# Altium schematic sheet 12V_Buck_Motor.SchDoc
size 259 x 167 mm; SheetNumber: 3; SheetTotal: 7
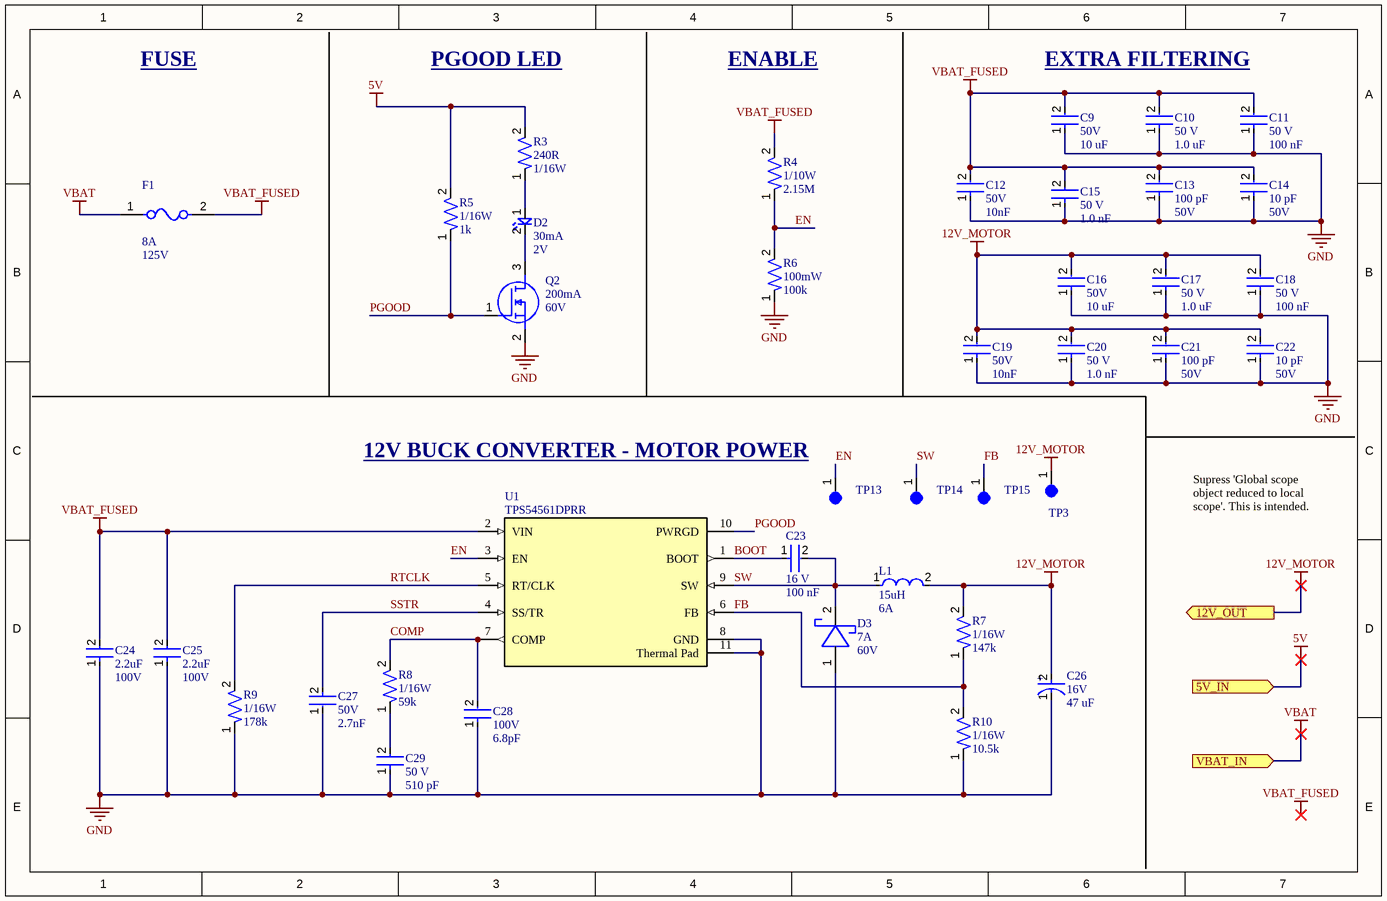
[diagram p0: 12V_Buck_Motor.SchDoc]

## Parts
C9  Voltage: 50V  Capacitance: 10 uF  [CAP-1210]  (hidden comment: CL32B106KBJNNNE)
C10  Voltage: 50 V  Capacitance: 1.0 uF  [CAP-0805]  (hidden comment: CC0805KKX7R9BB105)
C11  Voltage Rating: 50 V  Capacitance: 100 nF  [CAP-0805]  (hidden comment: CC0805KRX7R9BB104)
C12  Voltage: 50V  Capacitance: 10nF  [CAP-0805]  (hidden comment: GRM2195C1H103JA01D)
C13  Capacitance: 100 pF  Voltage: 50V  [CAP-0402]  (hidden comment: CC0402JRNPO9BN101)
C14  Capacitance: 10 pF  Voltage: 50V  [CAP-0402]  (hidden comment: CC0402JRNPO9BN100)
C15  Voltage: 50 V  Capacitance: 1.0 nF  [CAP-0402]  (hidden comment: CC0402KRX7R9BB102)
C16  Voltage: 50V  Capacitance: 10 uF  [CAP-1210]  (hidden comment: CL32B106KBJNNNE)
C17  Voltage: 50 V  Capacitance: 1.0 uF  [CAP-0805]  (hidden comment: CC0805KKX7R9BB105)
C18  Voltage Rating: 50 V  Capacitance: 100 nF  [CAP-0805]  (hidden comment: CC0805KRX7R9BB104)
C19  Voltage: 50V  Capacitance: 10nF  [CAP-0805]  (hidden comment: GRM2195C1H103JA01D)
C20  Voltage: 50 V  Capacitance: 1.0 nF  [CAP-0402]  (hidden comment: CC0402KRX7R9BB102)
C21  Capacitance: 100 pF  Voltage: 50V  [CAP-0402]  (hidden comment: CC0402JRNPO9BN101)
C22  Capacitance: 10 pF  Voltage: 50V  [CAP-0402]  (hidden comment: CC0402JRNPO9BN100)
C23  Voltage Rating: 16 V  Capacitance: 100 nF  [CAP-0402]  (hidden comment: CC0402KRX7R7BB104)
C24  Capacitance: 2.2uF  Voltage: 100V  [CAP-1206]  (hidden comment: CC1206KKX7R0BB225)
C25  Capacitance: 2.2uF  Voltage: 100V  [CAP-1206]  (hidden comment: CC1206KKX7R0BB225)
C26  Voltage: 16V  Capacitance: 47 uF  [CAP-47U-0001]  (hidden comment: 16SVPG47M)
C27  Voltage: 50V  Capacitance: 2.7nF  [CAP-0805]  (hidden comment: GRM2165C1H272JA01D)
C28  Voltage: 100V  Capacitance: 6.8pF  [CAP-0603]  (hidden comment: CC0603CRNPO0BN6R8)
C29  Voltage: 50 V  Capacitance: 510 pF  [CAP-0402]  (hidden comment: 0402N511J500CT)
D2  Forward Current: 30mA  Forward Voltage: 2V  [LED-0603]  (hidden comment: BL-HKC36G-AV-TRB)
D3  Forward Current: 7A  Reverse Voltage (DC): 60V  [DO-POWERDI5]  (hidden comment: PDS760-13)
F1  Fuse Current: 8A  Voltage Rating: 125V  [FUSE-0001]  (hidden comment: 01550900M)
L1  Inductance: 15uH  Current Rating: 6A  [IND-15U-0002]  (hidden comment: CSAD1010-150M)
Q2  Continuous Current: 200mA  Voltage: 60V  [IC-SOT23-3]  (hidden comment: T2N7002AK,LM)
R3  Resistance: 240R  Power: 1/16W  [RES-0402]  (hidden comment: RC0402FR-07240RL)
R4  Power: 1/10W  Resistance: 2.15M  [RES-0603]  (hidden comment: RC0603FR-072M15L)
R5  Power: 1/16W  Resistance: 1k  [RES-0402]  (hidden comment: RC0402FR-071KL)
R6  Power: 100mW  Resistance: 100k  [RES-0603]  (hidden comment: RC0603FR-07100KL)
R7  Power: 1/16W  Resistance: 147k  [RES-0402]  (hidden comment: RC0402FR-07147KL)
R8  Power: 1/16W  Resistance: 59k  [RES-0402]  (hidden comment: RC0402FR-0759KL)
R9  Power: 1/16W  Resistance: 178k  [RES-0402]  (hidden comment: RTT021783FTH)
R10  Power: 1/16W  Resistance: 10.5k  [RES-0402]  (hidden comment: RC0402FR-0710K5L)
TP3  5003  [TEST-POINT-0001]  (value not drawn)
TP13  5003  [TEST-POINT-0001]  (value not drawn)
TP14  5003  [TEST-POINT-0001]  (value not drawn)
TP15  5003  [TEST-POINT-0001]  (value not drawn)
U1  TPS54561DPRR  [IC-10WSON]

## Ports
5V_IN (in, see TLD[5D], 7V_BUCK_LDOs[2B], MCU_CAN[7E]), 12V_OUT (out, see TLD[5E]), VBAT_IN (in, see TLD[6E], 7V_BUCK_LDOs[2B])

## Nets
5V: R3.2 R5.2 ; port 5V_IN
12V_MOTOR: C16.2 C17.2 C18.2 C19.2 C20.2 C21.2 C22.2 C26.2(A) L1.2 R7.2 TP3.1 ; port 12V_OUT
GND: C9.1 C10.1 C11.1 C12.1 C13.1 C14.1 C15.1 C16.1 C17.1 C18.1 C19.1 C20.1 C21.1 C22.1 C24.1 C25.1 C26.1(C) C27.1 C28.1 C29.1 D3.1(CATHODE) Q2.2(S) R6.1 R9.1 R10.1 U1.8(GND) U1.11(Thermal_Pad)
VBAT: F1.1 ; port VBAT_IN
VBAT_FUSED: C9.2 C10.2 C11.2 C12.2 C13.2 C14.2 C15.2 C24.2 C25.2 F1.2 R4.2 U1.2(VIN)
BOOT: C23.1 U1.1(BOOT)
COMP: C28.2 R8.2 U1.7(COMP)
EN: R4.1 R6.2 TP13.1 U1.3(EN)
FB: R7.1 R10.2 TP15.1 U1.6(FB)
PGOOD: Q2.1(G) R5.1 U1.10(PWRGD)
RTCLK: R9.2 U1.5(RT/CLK)
SSTR: C27.2 U1.4(SS/TR)
SW: C23.2 D3.2(ANODE) L1.1 TP14.1 U1.9(SW)
NetC29_2: C29.2 R8.1
NetD2_1: D2.1 R3.1
NetD2_2: D2.2 Q2.3(D)

## Notes on the sheet
- FUSE
- PGOOD LED
- ENABLE
- EXTRA FILTERING
- 12V BUCK CONVERTER - MOTOR POWER
- Supress 'Global scope object reduced to local scope'. This is intended.
- Labels drawn without touching a wire or pin: VBAT_FUSED
- DWG. NO.
- REV.
- SHT.
- REVISION
- DESCRIPTION
- DATE
- APPROVED
- THIS DOCUMENT AND THE DATA DISCLOSED HEREIN OR HEREWITH IS THE PROPERTY OF ALTIUM LIMITED AND MAY BE FREELY DISTRIBUTED IN WHOLE. NO RIGHTS ARE RESERVED OR EXPRESS OR IMPLIED WARANTEE GIVEN.
- ENG:
- DSN:
- APPROVALS
- PROJECT
- DOCUMENT REVISION:
- DESIGN ITEM:
- CHK:
- BOM:
- REFERENCE DOCUMENTS
- PROJECT REVISION:
- TITLE
- FAB DWG:
- PCB DWG:
- ASSY DWG:
- SCALE:
- SIZE
- C
- CAGE CODE
- FILE NAME
- DWG NO.
- SHEET
- OF
- REV
- (in symbol CAP-47U-0001) +

## Library data of the parts
C9 C16 = CAP-10U-0002: CAP CER 10UF 50V X7R 1210; Device Class: Ceramic; Size: 1210; ComponentLink1Description: Datasheet; ComponentLink1URL: https://mm.digikey.com/Volume0/opasdata/d220001/medias/docus/41/CL32B106KBJNNNE_Spec.pdf
C10 C17 = CAP-1U-0001: CAP CER 1UF 50V X7R 0805; ComponentLink2URL: https://www.yageo.com/upload/media/product/productsearch/datasheet/mlcc/UPY-GPHC_X7R_6.3V-to-250V_24.pdf; ComponentLink2Description: Datasheet; Device Class: Ceramic; Size: 0805
C11 C18 = CAP-0.1U-0002: CAP CER 0.1UF 50V X7R 0805; ComponentLink2Description: Datasheet; ComponentLink2URL: https://www.yageo.com/upload/media/product/productsearch/datasheet/mlcc/UPY-GPHC_X7R_6.3V-to-250V_24.pdf; Device Class: Ceramic; Size: 0805
C12 C19 = CAP-10N-0001: CAP CER 10000PF 50V C0G/NP0 0805; Device Class: Ceramic; Size: 0805; ComponentLink1Description: Datasheet; ComponentLink1URL: https://search.murata.co.jp/Ceramy/image/img/A01X/G101/ENG/GRM2195C1H103JA01-01.pdf
C13 C21 = CAP-100P-0001: CAP CER 100PF 50V C0G/NPO 0402; Device Class: Ceramic; Size: 0402; ComponentLink1Description: Datasheet; ComponentLink1URL: https://www.yageo.com/upload/media/product/productsearch/datasheet/mlcc/UPY-GP_NP0_16V-to-50V_18.pdf
C14 C22 = CAP-10P-0001: CAP CER 10PF 50V C0G/NPO 0402; Device Class: Ceramic; Size: 0402; ComponentLink1Description: Datasheet; ComponentLink1URL: https://www.yageo.com/upload/media/product/productsearch/datasheet/mlcc/UPY-GP_NP0_16V-to-50V_18.pdf
C15 C20 = CAP-1N-0001: CAP CER 1000PF 50V X7R 0402; ComponentLink2Description: Datasheet; ComponentLink2URL: http://www.yageo.com/documents/recent/UPY-GP_NP0_16V-to-50V_16.pdf; Device Class: Ceramic; Size: 0402
C23 = CAP-0.1U-0001: CAP CER 0.1UF 16V X7R 0402; ComponentLink2Description: Datasheet; ComponentLink2URL: https://www.yageo.com/upload/media/product/productsearch/datasheet/mlcc/UPY-GPHC_X7R_6.3V-to-250V_24.pdf; Device Class: Ceramic; Size: 0402
C24 C25 = CAP-2.2U-0001: CAP CER 2.2UF 100V X7R 1206; Device Class: Ceramic; Size: 1206; ComponentLink1Description: Datasheet; ComponentLink1URL: https://www.yageo.com/upload/media/product/productsearch/datasheet/mlcc/UPY-GPHC_X7R_6.3V-to-250V_24.pdf
C26 = CAP-47U-0001: CAP ALUM POLY 47UF 20% 16V SMD; Device Class: Electrolytic; ComponentLink1Description: Datasheet; ComponentLink1URL: https://industrial.panasonic.com/cdbs/www-data/pdf/AAB8000/AAB8000C175.pdf
C27 = CAP-2.7N-0001: CAP CER 2700PF 50V C0G/NP0 0805; ComponentLink1Description: Datasheet; ComponentLink1URL: https://search.murata.co.jp/Ceramy/image/img/A01X/G101/ENG/GRM2165C1H272JA01-01.pdf; Device Class: Ceramic; Size: 0805
C28 = CAP-6.8P-0001: CAP CER 6.8PF 100V C0G/NPO 0603; Device Class: Ceramic; ComponentLink1Description: Datasheet; ComponentLink1URL: https://www.yageo.com/upload/media/product/productsearch/datasheet/mlcc/UPY-GPHC_X7R_6.3V-to-250V_24.pdf; Size: 0603
C29 = CAP-510P-0001: CAP CER 510PF 50V C0G/NP0 0402; ComponentLink2Description: Datasheet; ComponentLink2URL: https://www.mouser.com/ProductDetail/Walsin/0402N511J500CT?qs=u16ybLDytRbq33ukPPRl4A%3D%3D&srsltid=AfmBOoq1-HCbTRqPV3GtwyI6lHLBf095DSA3Qg1Qkiix4a-obr82TmJ6; Device Class: Ceramic; Size: 0402
D2 = LED-0001: LED YELLOW CLEAR 0603 SMD; ComponentLink1Description: Datasheet; ComponentLink1URL: https://www.americanbrightled.com/pdffiles/led-components/smt/BL-HKC36G-AV-TRB.pdf
D3 = DIO-SCHOTTKY-0001: DIODE SCHOTTKY 60V 7A POWERDI5; ComponentLink1Description: Datasheet; ComponentLink1URL: https://www.diodes.com/assets/Datasheets/PDS760.pdf
F1 = FUSE-0001: FUSE BLOK CARTRIDGE 125V 10A SMD; ComponentLink2Description: Datasheet; ComponentLink2URL: https://www.littelfuse.com/~/media/electronics/datasheets/fuses/littelfuse_fuse_154_154t_154l_154tl_datasheet.pdf.pdf
L1 = IND-15U-0002-NoJLC: SMD MOLDING POWER CHOKE; ComponentLink1Description: Datasheet; ComponentLink1URL: https://www.digikey.com/en/products/detail/codaca/CSAD1010-150M/16633512?s=N4IgjCBcoBwAxVAYygMwIYBsDOBTANCAPZQDaIALHAExwDMEAuoQA4AuUIAymwE4CWAOwDmIAL6Ew1MAE5EIFJAw4CxMiGoy6AdmoUQhajGqa6BjTDp6zhywFY4c23UtOLFbVXPVtYK3e9dODsbdwA2OxgQZhB2Th4BEXFJTQhoBTQsPEISSHITS0do1g5Ibj4hUQkNOBhteTiygFVBfjYAeVQAWVx0bABXXlxzfs4AVoAJcwBbIU4wAMJp9AAPeYDq2hgo9MaQFrbOnr7B4cJRsoBBGbmyuwA6DcIAWmp5RT5%2B1VzyAMYxAFAA
Q2 = NMOS-200MA-0001: MOSFET N-CH 60V 200MA SOT23; ComponentLink1Description: Datasheet; ComponentLink1URL: https://toshiba.semicon-storage.com/info/T2N7002AK_datasheet_en_20150401.pdf?did=29712&prodName=T2N7002AK
R3 = RES-240-0001: 240R 0.063W 1% 0402 (1005 Metric)  SMD; Tolerance: 1%; Size: 0402; ComponentLink1Description: Datasheet; ComponentLink1URL: https://www.yageo.com/upload/media/product/products/datasheet/rchip/PYu-RC_Group_51_RoHS_L_12.pdf
R4 = RES-2.15M-0001: RES SMD 2.15M OHM 1% 1/10W 0603; Tolerance: 1%; Size: 0603; ComponentLink1Description: Datasheet; ComponentLink1URL: https://www.yageo.com/upload/media/product/products/datasheet/rchip/PYu-RC_Group_51_RoHS_L_12.pdf
R5 = RES-1k-0001: RES 1K OHM 1% 1/16W 0402; Tolerance: 1%; Size: 0402; ComponentLink1Description: Datasheet; ComponentLink1URL: https://www.yageo.com/upload/media/product/products/datasheet/rchip/PYu-RC_Group_51_RoHS_L_12.pdf
R6 = RES-100k-0001: RES SMD 100K OHM 1% 1/10W 0603; Tolerance: 1%; Size: 0603; ComponentLink1Description: Datasheet; ComponentLink1URL: https://www.yageo.com/upload/media/product/products/datasheet/rchip/PYu-RC_Group_51_RoHS_L_12.pdf
R7 = RES-147k-0001: RES 147K OHM 1% 1/16W 0402; Tolerance: 1%; Size: 0402; ComponentLink1Description: Datasheet; ComponentLink1URL: https://www.yageo.com/upload/media/product/products/datasheet/rchip/PYu-RC_Group_51_RoHS_L_12.pdf
R8 = RES-59k-0001: RES 59K OHM 1% 1/16W 0402; Tolerance: 1%; Size: 0402; ComponentLink1Description: Datasheet; ComponentLink1URL: https://www.digikey.com/en/products/detail/yageo/RC0402FR-0759KL/2827634?s=N4IgTCBcDaIEoGEAMAWJYBicC0SDsArAJwDSAMiALoC%2BQA
R9 = RES-178k-0001: 62.5mW Thick Film Resistors 50V ±100ppm/℃ ±1% 178kΩ 0402 Chip Resistor - Surface Mount ROHS; Tolerance: 1%; Size: 0402; ComponentLink1Description: Datasheet; ComponentLink1URL: https://www.lcsc.com/datasheet/lcsc_datasheet_2304140030_RALEC-RTT021783FTH_C102842.pdf
R10 = RES-10.5k-0001: RES 10.5K OHM 1% 1/16W 0402; Tolerance: 1%; Size: 0402; ComponentLink1Description: Datasheet; ComponentLink1URL: https://www.yageo.com/upload/media/product/products/datasheet/rchip/PYu-RC_Group_51_RoHS_L_12.pdf
TP3 TP13-TP15 = TEST-POINT-0001: Oranange PC Test Point, Miniature Phoisphor Bronze Silver Plating Through Hole Mounting Type
U1 = IC-BUCK-0001: IC REG BUCK ADJ 5A 10WSON; ComponentLink1Description: Datasheet; ComponentLink1URL: https://www.ti.com/general/docs/suppproductinfo.tsp?distId=10&gotoUrl=https%3A%2F%2Fwww.ti.com%2Flit%2Fgpn%2Ftps54561